# EasyEDA Pro project Magmattic PCB_V2.eprj, board Adafruit TPS65131 Split Power Supply
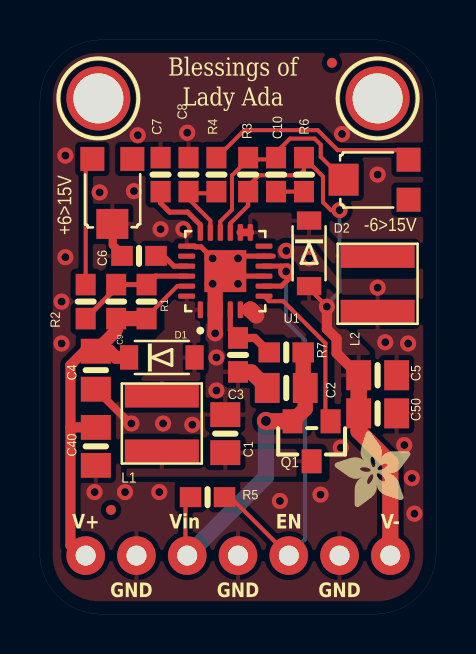
[diagram p12: board, top side]
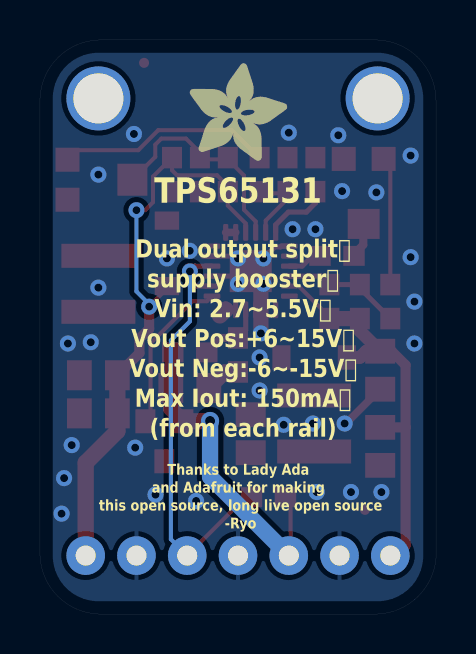
[diagram p13: board, bottom side, seen from below]

Outline 19.81 x 28.7 mm; copper layers: Top Layer, Inner1, Inner2, Inner3, Inner4, Inner5, Inner6, Inner7, Inner8, Inner9, Inner10, Inner11, Inner12, Inner13, Inner14, Inner15, Inner16, Inner17, Inner18, Inner19, Inner20, Inner21, Inner22, Inner23, Inner24, Inner25, Inner26, Inner27, Inner28, Inner29, Inner30, Bottom Layer. Coordinates in mm from the lower left corner of the outline.
Outline path: 0,25.65 0,2.79 arc(0.93,0.85) 2.92,0 16.89,0 arc(18.92,0.89) 19.81,2.92 19.81,25.78 arc(18.92,27.81) 16.89,28.7 2.92,28.7 arc(0.84,27.77) 0,25.65
Stack: Top Layer 0.035mm / Dielectric1 1.51mm FR4 er 4.5 / Bottom Layer 0.035mm

## Design rules (mm)
template: User Custom Config
spacing safeClearance (default): track to track 0.152, other pairs 0.152 to 0.3
track width trackWidth (default): min 0.127, default 0.254, max 2.54
differential pair differentialPair (default): width min 0.127, default 0.254, max 2.54; gap min 0.152, default 0.152
via viaSize (default): diameter min 0.5, default 0.61, max 10; hole min 0.3, default 0.305, max 5.999
pour ie1 uses CopperRegion
pour ie2 uses CopperRegion1
pour ie3 uses CopperRegion2
pour ie111 uses CopperRegion3
pour ie114 uses CopperRegion4
pour ie120 uses CopperRegion5
pour ie127 uses CopperRegion7

## Placement (name value [footprint] x y rotation side)
C1  22uF/16V  [0805-NO]  9.27 9.02 270 top
C2  22uF/16V  [0805-NO]  12.32 11.3 0 top
C3  0.1uF  [0603-NO]  9.91 12.95 90 top
C4  22uF/16V  [0805-NO]  2.79 12.19 90 top
C5  22uF/16V  [0805-NO]  16.89 11.94 180 top
C6  10nF  [0603-NO]  4.95 17.91 0 top
C7  4.7nF  [0603-NO]  6.03 21.97 270 top
C8  220nF  [0603-NO]  7.43 21.97 270 top
C9  15pF  [0603-NO]  3.81 15.62 90 top
C10  15pF  [0603-NO]  11.81 21.97 90 top
C40  22uF/16V  [0805-NO]  2.79 8.38 90 top
C50  22uF/16V  [0805-NO]  16.89 10.03 180 top
D1  MBR120  [SOD-123FL]  6.1 12.83 0 top
D2  MBR120  [SOD-123FL]  13.46 18.03 270 top
FID1  -  [FIDUCIAL_0.5MM]  3.56 5.21 0 top
FID2  -  [FIDUCIAL_0.5MM]  14.6 27.56 0 top
JP2  HEADER-1X7THICKER  [1X07_ROUND_76]  9.91 2.92 0 top
L1  4.7uH 2A / YSMC0420V-4R7M  [INDUCTOR_4X4MM_NR401]  6.1 9.53 90 top
L2  4.7uH 2A / YSMC0420V-4R7M  [INDUCTOR_4X4MM_NR401]  16.89 16.51 270 top
PLABEL0  -  [PLABEL0]  2.29 4.57 0 top
PLABEL1  -  [PLABEL1]  4.83 1.27 0 top
PLABEL2  -  [PLABEL2]  7.24 4.57 0 top
PLABEL3  -  [PLABEL3]  9.91 1.27 0 top
PLABEL4  -  [PLABEL4]  12.45 4.7 0 top
PLABEL5  -  [PLABEL5]  14.99 1.27 0 top
PLABEL6  -  [PLABEL6]  17.53 4.57 0 top
PLABEL7  -  [PLABEL7]  9.91 25.78 0 top
PLABEL8  -  [PLABEL8]  1.4 21.08 90 top
PLABEL9  -  [PLABEL9]  16.89 19.37 0 top
PLABEL10  -  [PLABEL10]  9.27 20.83 180 bottom
PLABEL11  -  [PLABEL11]  9.91 10.92 180 bottom
Q1  AO3401A  [SOT23-WIDE]  13.59 8.64 180 top
R1  560K  [0603-NO]  5.33 15.62 270 top
R2  47K  [0603-NO]  2.29 15.62 270 top
R3  750K  [0603-NO]  10.41 21.97 90 top
R4  59K  [0603-NO]  8.83 21.97 270 top
R5  47K  [0603-NO]  8.38 5.84 180 top
R6  47K  [0603-NO]  13.21 21.97 270 top
R7  100  [0603-NO]  12.32 13.08 180 top
U1  TPS65131  [QFN24_4MM]  9.27 17.14 90 top
U$1  MOUNTINGHOLE2.5  [MOUNTINGHOLE_2.5_PLATED]  2.92 25.78 0 top
U$2  MOUNTINGHOLE2.5  [MOUNTINGHOLE_2.5_PLATED]  16.89 25.78 0 top
U$3  -  [ADAFRUIT_3.5MM]  18.54 5.33 90 top
U$4  -  [ADAFRUIT_5MM]  12.32 22.67 180 bottom
VR1  100K  [TRIMPOT_BOURNS_TC33X-2]  3.62 20.95 180 top
VR2  100K  [TRIMPOT_BOURNS_TC33X-2]  16.64 21.72 90 top

## Footprints (pads in the part's own frame, mm; a bottom-side part is the same pattern mirrored in y, then rotated)
1X07_ROUND_76
  round 1.931 hole 1: 1(-7.62,0) 2(-5.08,0) 3(-2.54,0) 4(0,0) 5(2.54,0) 6(5.08,0) 7(7.62,0)
0603-NO
  rect 1.075x1 smd: 1(-0.85,0) 2(0.85,0)
0805-NO
  rect 1.24x1.5 smd: 1(-0.95,0) 2(0.95,0)
FIDUCIAL_0.5MM
  round 0.5 smd: 1(0,0)
INDUCTOR_4X4MM_NR401
  rect 1.2x3.7 smd: P$1(-1.4,0) P$2(1.4,0)
MOUNTINGHOLE_2.5_PLATED
  round 3.2 hole 2.5: P$1(0,0)
QFN24_4MM
  rrect 0.84x0.26 smd: 1(-1.935,1.25) 2(-1.935,0.75) 3(-1.935,0.25) 4(-1.935,-0.25) 5(-1.935,-0.75) 6(-1.935,-1.25) 13(1.935,-1.25) 14(1.935,-0.75) 15(1.935,-0.25) 16(1.935,0.25) 17(1.935,0.75) 18(1.935,1.25)
  rrect 0.26x0.84 smd: 7(-1.25,-1.935) 8(-0.75,-1.935) 9(-0.25,-1.935) 10(0.25,-1.935) 11(0.75,-1.935) 12(1.25,-1.935) 19(1.25,1.935) 20(0.75,1.935) 21(0.25,1.935) 22(-0.25,1.935) 23(-0.75,1.935) 24(-1.25,1.935)
  rect 2.1x2.1 smd: 25(0,0)
SOD-123FL
  rect 0.91x1.22 smd: A(1.637,0) C(-1.637,0)
SOT23-WIDE
  rect 1x1.2 smd: 1(-0.95,-1) 2(0.95,-1) 3(0,1)
TRIMPOT_BOURNS_TC33X-2
  rect 1.2x1.2 smd: 1(-1,-1.8) 3(1,-1.8)
  rect 1.6x1.5 smd: 2(0,1.45)

## Nets
+12V: C4.2 C9.1 C40.2 D1.C JP2.1 R1.2 U1.23
-12V: C5.2 C50.2 D2.A JP2.7 R3.1 R6.1 U1.15
GND: C1.1 C2.1 C3.1 C4.1 C5.1 C6.1 C7.1 C8.1 C40.1 C50.1 JP2.2 JP2.4 JP2.6 L2.P$2 U1.2 U1.3 U1.9 U1.11 U1.19 U1.25 VR1.2
VDD: C2.2 JP2.3 Q1.2 R5.2 R7.1 U1.5 U1.6
VIN: C3.2 R7.2 U1.4
BSW: Q1.1 U1.7
ENABLE: JP2.5 R5.1 U1.8 U1.10
FBN: C10.2 R3.2 U1.16 VR2.2
FBP: C9.2 R1.1 R2.2 U1.22
INP: D1.A L1.P$2 U1.1 U1.24
N$1: C6.2 U1.21
N$2: C1.2 L1.P$1 Q1.3
N$3: R2.1 VR1.3
N$4: R4.1 VR2.3
N$5: C10.1 R6.2
N$17: C7.2 U1.18
OUTN: D2.C L2.P$1 U1.13 U1.14
VREF: C8.2 R4.2 U1.17

Pads without a net: FID1 1; FID2 1; U1 12 20; U$1 P$1; U$2 P$1; VR1 1; VR2 1

## Via types
v1: diameter 0.806, hole 0.4, Top Layer to Bottom Layer, 36 vias
v2: diameter 0.8, hole 0.394, Top Layer to Bottom Layer, 3 vias
v3: diameter 0.906, hole 0.5, Top Layer to Bottom Layer, 1 via

## Routing (per net, layer and track width the routed paths; a pad name or vN(x,y) marks a point on that pad's centre or on a via; arc(x,y) is an arc through that point)
+12V: length 20.9
  Top Layer w0.203: R1.2 5.33,14.86 6.87,16.39 7.34,16.39
  Top Layer w0.508: 1.52,9.33 1.52,3.43 2.03,2.92 JP2.1 ; 1.52,9.33 C40.2 ; 1.52,9.33 1.52,12.45 2.22,13.14 2.79,13.14
  Top Layer w0.635: D1.C 3.81,12.83 3.49,13.14 2.79,13.14 3.81,14.16 C9.1
  Top Layer w0.762: R1.2 C9.1
-12V: length 30.3
  Top Layer w0.203: D2.A 13.46,16.27 14.36,15.37 v2(14.35,15.37) ; U1.15 9.52,19.53 10.41,20.42 R3.1 10.41,21.4 10.95,21.94 12.95,21.94 13.21,22.19 R6.1 14.16,21.87 14.16,20.59 14.56,20.19 v2(14.99,20.19)
  Top Layer w0.508: v2(14.35,15.37) 14.35,14.25 14.84,13.77 14.84,13.04 C5.2
  Top Layer w0.813: JP2.7 17.53,7.56 15.94,9.14 C50.2 C5.2
  Bottom Layer w0.203: v2(14.35,15.37) 14.35,15.49 14.99,16.13 v2(14.99,20.19)
GND: length 15.3
  Top Layer w0.254: 11.67,17.89 U1.11 10.02,17.89 9.4,17.27 ; 7.34,18.39 7.74,18.39 7.78,18.36 8.06,18.36 U1.25 9.4,17.27 ; 9.4,17.27 9.78,16.89 U1.9
  Top Layer w0.381: C4.1 4.51,9.53 v1(4.57,9.53)
  Top Layer w0.406: C6.1 4.1,18 3.64,18.46 3.64,19.49 VR1.2
  Top Layer w0.762: 8.76,16.13 v1(8.76,14.03) ; C3.1 10.57,12.1 C2.1
  vias: v1(1.08,15.62) v1(1.08,13.53) v1(1.27,22.92) v1(1.27,17.84) v1(2.73,6.1) v1(2.98,21.08) v1(4.25,6.1) v1(4.7,21.15) v1(4.89,23.94) v1(5.97,6.1) v1(6.03,19.24) v1(6.16,9.53) v1(7.18,19.24) v1(7.37,24.07) v1(7.62,9.46) v1(8.64,17.78) v1(8.64,16.51) v1(8.83,12.83) v1(8.83,11.18) v1(9.91,17.78) v1(9.91,16.51) v1(12,5.65) v1(12.32,18.16) v1(13.46,17.78) v1(14.03,5.97) v1(15.11,24) v1(15.05,8.32) v1(16.89,21.97) v1(16.89,16.32) v1(17.27,13.59) v1(18.22,8.45) v1(18.41,13.53) v1(18.61,6.79) v1(18.73,5.02)
VDD: length 16.9
  Top Layer w0.203: JP2.3 7.28,3.01 7.28,5.59 R5.2
  Top Layer w0.762: R7.1 13.17,11.4 C2.2 13.27,10.27 Q1.2
  Top Layer w0.813: v3(11.3,9.65) 11.32,9.64 Q1.2 ; U1.6 10.53,15.21 10.81,14.93
  Bottom Layer w0.813: v3(11.3,9.65) 11.3,6.86 JP2.3
VIN: length 3.4
  Top Layer w0.254: 9.91,13.8 9.52,14.19 U1.4
  Top Layer w0.406: 9.91,13.8 10.75,13.8 R7.2
BSW: length 8.1
  Top Layer w0.203: U1.7 11.46,15.64 12.17,15.64 14.28,13.53 14.28,9.9 Q1.1
ENABLE: length 23
  Top Layer w0.203: 12.05,17.39 v2(12.31,17.13) ; JP2.5 9.53,5.84 R5.1
  Top Layer w0.254: U1.10 12.43,17.39 12.43,16.75 12.08,16.39 U1.8
  Bottom Layer w0.203: v2(12.31,17.13) 12.31,14.63 13.26,13.68 13.26,3.74 JP2.5
FBN: length 10.9
  Top Layer w0.203: 10.41,22.73 9.61,21.92 9.61,20.21 9.02,19.63 U1.16 ; 10.41,22.73 R3.2 ; 10.41,22.73 11.72,22.73 C10.2 11.81,23.08 12.51,23.77 13.74,23.77 14.04,23.47 14.04,22.86 VR2.2
FBP: length 6
  Top Layer w0.254: R2.2 3.81,16.3 C9.2 R1.1 5.76,16.89 7.34,16.89
N$1: length 1.7
  Top Layer w0.254: 7.34,17.39 6.7,17.39 6.18,17.91 C6.2
N$3: length 6.4
  Top Layer w0.203: VR1.3 2.29,22.42 R2.1
N$4: length 10.8
  Top Layer w0.203: VR2.3 17.96,23.19 14.89,23.19 13.89,24.19 10.22,24.19 8.85,22.82 R4.1
N$5: length 1.4
  Top Layer w0.203: C10.1 R6.2
N$17: length 3.4
  Top Layer w0.254: U1.18 8.02,19.46 7.39,20.1 6.49,20.1 6.03,20.55 C7.2
VREF: length 4.1
  Top Layer w0.203: 7.51,21.04 8.74,21.04 R4.2 ; 7.51,21.04 C8.2 ; 7.51,21.04 7.45,21.04 7.49,20.99 7.49,20.81 7.38,20.81 8.52,19.67 U1.17
OUTN: length 0.5
  Top Layer w0.381: U1.14 U1.13

## Copper pours and planes (outline as drawn; the poured copper is in the pictures)
-12V on Top Layer: 12.83,16.89 13.84,16.89 15.11,15.62 15.11,14.48 16.51,13.08 16.51,9.4 14.73,9.4 14.73,13.84 12.83,15.75
GND on Top Layer: 0.38,28.32 19.43,28.32 19.43,0.38 0.38,0.38
GND on Top Layer: 8.38,9.27 8.38,16.89 9.27,16.89 9.27,12.7 11.68,12.7 11.94,12.45 11.94,10.67 10.41,9.14 8.51,9.14
GND on Bottom Layer: 0.38,28.32 19.43,28.32 19.43,0.38 0.38,0.38
VDD on Top Layer: 10.03,13.97 10.03,15.62 12.32,15.62 13.97,13.97 13.97,10.54 13.34,9.91 13.34,9.14 12.06,9.14 12.06,10.03 12.57,10.54 12.57,13.59 12.19,13.97
INP on Top Layer: 7.84,16.15 8.02,15.97 8.02,10.94 7.62,10.54 4.83,10.54 4.32,11.05 4.32,11.81 5.08,11.81 5.59,12.32 5.59,13.59 6.22,14.22 6.22,15.24 7.13,16.15
N$2 on Top Layer: 4.32,8.76 4.32,6.86 14.22,6.86 14.22,8 13.97,8.25 7.37,8.25 6.86,8.76
OUTN on Top Layer: 10.03,18.8 10.03,20.07 14.22,20.07 14.22,19.05 15.24,18.03 18.67,18.03 18.67,17.02 15.04,17.02 13.72,18.67 10.16,18.67

## Text on the board
Bottom Silkscreen Layer: Dual output split / supply booster / Vin: 2.7~5.5V / Vout Pos:+6~15V / Vout Neg:-6~-15V / Max Iout: 150mA / (from each rail) | TPS65131 | Thanks to Lady Ada / and Adafruit for making / this open source, long live open source / -Ryo
Top Silkscreen Layer: -6>15V | +6>15V | V+ | GND | Vin | EN | V- | Blessings of / Lady Ada
